# EAGLE design robomow_usb (EAGLE 9.6.2)
Assembly variants: ROBOMOW, SORENSEN
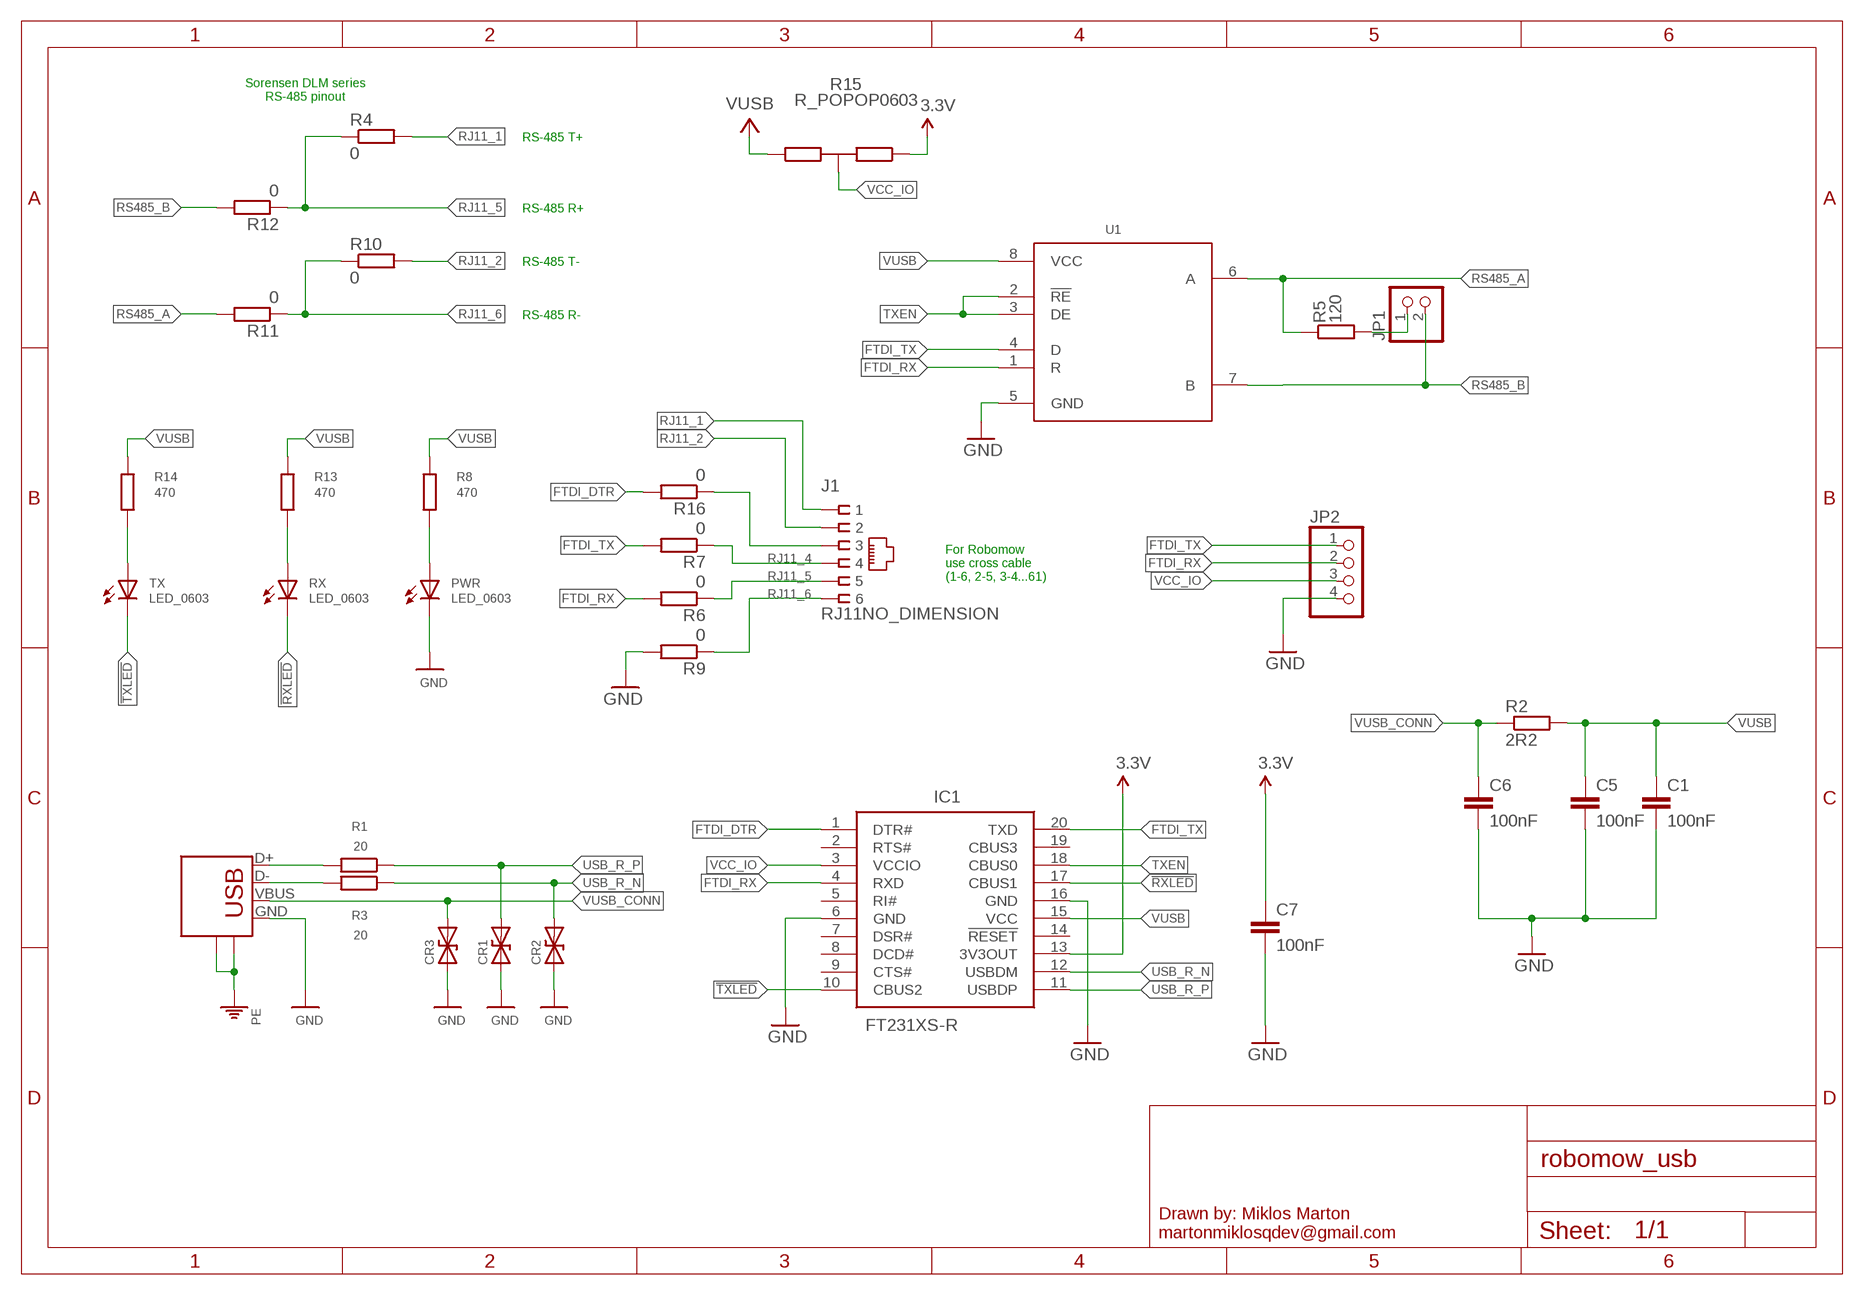
[diagram p0: schematic, sheet 1]

## Parts
C1  100nF  C-EUC0603  [C0603]  (not fitted in variant ROBOMOW)
C5  100nF  C-EUC0603  [C0603]
C6  100nF  C-EUC0603  [C0603]
C7  100nF  C-EUC0603  [C0603]
CR1  0603ESDA2-TR2  [0603]
CR2  0603ESDA2-TR2  [0603]
CR3  0603ESDA2-TR2  [0603]
IC1  FT231XS-R  [SOP64P599X175-20N]
J1  RJ11NO_DIMENSION  [RJ11-NO_SHIELD_NO_DIMENSION]
JP1  PINHD-1X2  [1X02]  (not fitted in variant ROBOMOW)
JP2  PINHD-1X4  [1X04]
JUSB  USBPTH  [USB-B-PTH]
PWR  LED_0603  LED-0603  [LED-603]
R1  20  R-EU_R0603  [R0603]
R2  2R2  R-EU_R0603  [R0603]
R3  20  R-EU_R0603  [R0603]
R4  0  R-EU_R0603  [R0603]  (not fitted in variant ROBOMOW)
R5  120  R-EU_R0603  [R0603]  (not fitted in variant ROBOMOW)
R6  0  R-EU_R0603  [R0603]  (not fitted in variant SORENSEN)
R7  0  R-EU_R0603  [R0603]  (not fitted in variant SORENSEN)
R8  470  R-EU_R0603  [R0603]
R9  0  R-EU_R0603  [R0603]  (not fitted in variant SORENSEN)
R10  0  R-EU_R0603  [R0603]  (not fitted in variant ROBOMOW)
R11  0  R-EU_R0603  [R0603]  (not fitted in variant ROBOMOW)
R12  0  R-EU_R0603  [R0603]  (not fitted in variant ROBOMOW)
R13  470  R-EU_R0603  [R0603]
R14  470  R-EU_R0603  [R0603]
R15  R_POPOP0603  [0603_POPOP]
R16  0  R-EU_R0603  [R0603]
RX  LED_0603  LED-0603  [LED-603]
TX  LED_0603  LED-0603  [LED-603]
U1  SN65HVD1176  SN65HVD1176DR  [D0008A_N]  (not fitted in variant ROBOMOW)

## Nets
3.3V: C7.1 IC1.13(3V3OUT) R15.A
!RXLED: IC1.17(CBUS1) RX.C
!TXLED: IC1.10(CBUS2) TX.C
FTDI_DTR: IC1.1(DTR#) R16.2
FTDI_RX: IC1.4(RXD) JP2.2 R6.2 U1.1(R)
FTDI_TX: IC1.20(TXD) JP2.1 R7.2 U1.4(D)
GND: C1.2 C5.2 C6.2 C7.2 CR1.1 CR2.1 CR3.1 IC1.6(GND) IC1.16(GND) JP2.4 JUSB.GND PWR.C R9.2 U1.5(GND)
N$1: J1.3 R16.1
PE: JUSB.P$1(SH1) JUSB.P$2(SH2)
RJ11_1: J1.1 R4.2
RJ11_2: J1.2 R10.2
RJ11_4: J1.4 R7.1
RJ11_5: J1.5 R4.1 R6.1 R12.1
RJ11_6: J1.6 R9.1 R10.1 R11.1
RS485_A: R5.1 R11.2 U1.6(A)
RS485_B: JP1.2 R12.2 U1.7(B)
RS485_TERM_ENABLE: JP1.1 R5.2
TXEN: IC1.18(CBUS0) U1.2(!RE) U1.3(DE)
USB_N [USB_DN]: JUSB.D- R3.2
USB_P [USB_DP]: JUSB.D+ R1.2
USB_R_N: CR2.2 IC1.12(USBDM) R3.1
USB_R_P: CR1.2 IC1.11(USBDP) R1.1
VCC_IO: IC1.3(VCCIO) JP2.3 R15.COM
VIN_LED_R1: PWR.A R8.2
VIN_LED_R2: R13.2 RX.A
VIN_LED_R3: R14.2 TX.A
VUSB: C1.1 C5.1 IC1.15(VCC) R2.2 R8.1 R13.1 R14.1 R15.A1(B) U1.8(VCC)
VUSB_CONN: C6.1 CR3.2 JUSB.VBUS R2.1
Unconnected: IC1.2(RTS#) IC1.5(RI#) IC1.7(DSR#) IC1.8(DCD#) IC1.9(CTS#) IC1.14(!RESET) IC1.19(CBUS3)

## Notes on the sheet
- Sorensen DLM series
  RS-485 pinout
- RS-485 T+
- RS-485 R+
- RS-485 T-
- RS-485 R-
- For Robomow
  use cross cable
  (1-6, 2-5, 3-4...61)

## Library data of the parts
C1 C5-C7 = rcl:C-EU: CAPACITOR, European symbol
CR1 CR2 = diode:0603ESDA2-TR2; NI_PN: 730401-01; OC_FARNELL: 1828736
CR3 = diode:0603ESDA2-TR2; NI_PN: 730401-01; OC_FARNELL: 1828736; OC_TME: B72500D0050A060
IC1 = FT231XS-R:FT231XS-R: FTDI Chip FT231XS-R, Interface RS232, RS422, RS485, SIE, UART 3MBd, 5 V, 20-pin, SSOP Source: Datasheet <http://uk.rs-online.com/web/p/products/7570032P>; DESCRIPTION: FTDI Chip FT231XS-R, Interface RS232, RS422, RS485, SIE, UART 3MBd, 5 V, 20-pin, SSOP; HEIGHT: 1.7526mm; MANUFACTURER_NAME: FTDI Chip; MANUFACTURER_PART_NUMBER: FT231XS-R; RS_PART_NUMBER: 7570032P
J1 = con-tycoelectronics:RJ11: CORCOM Modular RJ Jacks No Shield Source: www.tycoelectronics.com .. ENG_DS_1654001_1099_RJ_L_0507.pdf
JP1 = pinhead:PINHD-1X2: PIN HEADER
JP2 = pinhead:PINHD-1X4: PIN HEADER
JUSB = usb:USB: USB Connectors USB-B-PTH is fully proven SKU : PRT-00139 USB-miniB is fully proven SKU : PRT-00587 USB-A-PCB is untested. USB-A-H is throughly reviewed, but untested. Spark Fun Electronics SKU : PRT-00437 USB-B-SMT is throughly reviewed, but untested. Needs silkscreen touching up. USB-A-S has not been used/tested USB-MB-H has not been used/tested; OC_FARNELL: 2112373; OC_TME: USB-B-S-RA
PWR RX TX = dp_devices:LED: Light Emitting Diode
R1 R3 = rcl:R-EU_: RESISTOR, European symbol; OC_TME: SMD0805-20R
R2 R4-R7 R9-R12 R16 = rcl:R-EU_: RESISTOR, European symbol
R8 R13 R14 = rcl:R-EU_: RESISTOR, European symbol; OC_TME: 0603SAF1001T5E
R15 = martonmiklos:R_POPOP
U1 = SN65HVD1176D:SN65HVD1176DR; MANUFACTURER: Texas Instruments; PARTNUMBER: SN65HVD1176DR

## Net classes
0 default: width 0.203 mm
4 USB_DP: width 1.143 mm, drill 0.5 mm
5 USB_DN: width 1.143 mm, drill 0.5 mm, clearance 0.15 mm to class 4

## Board
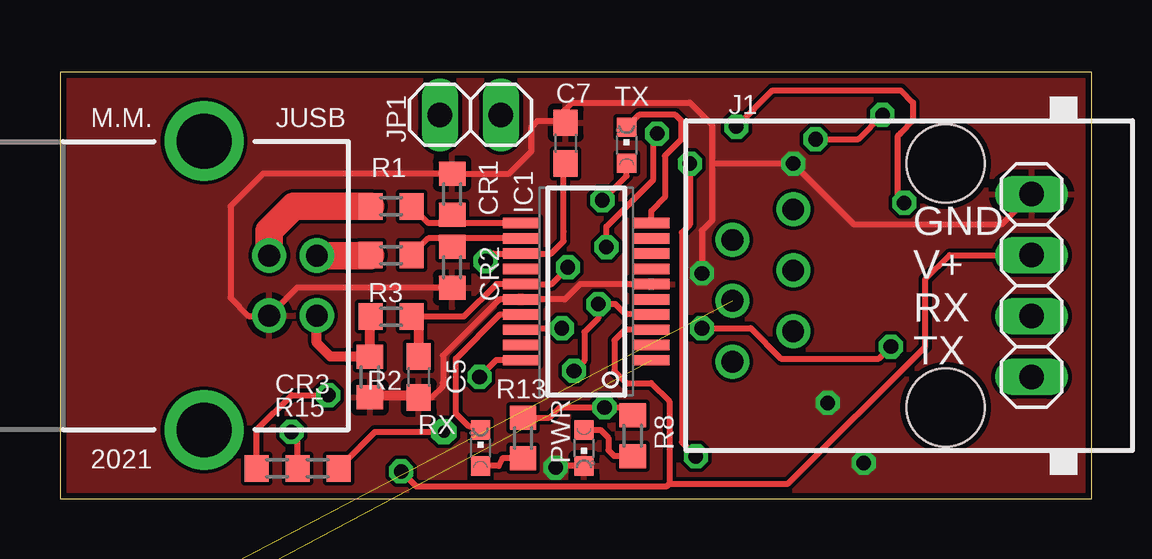
[diagram p1: board, top side]
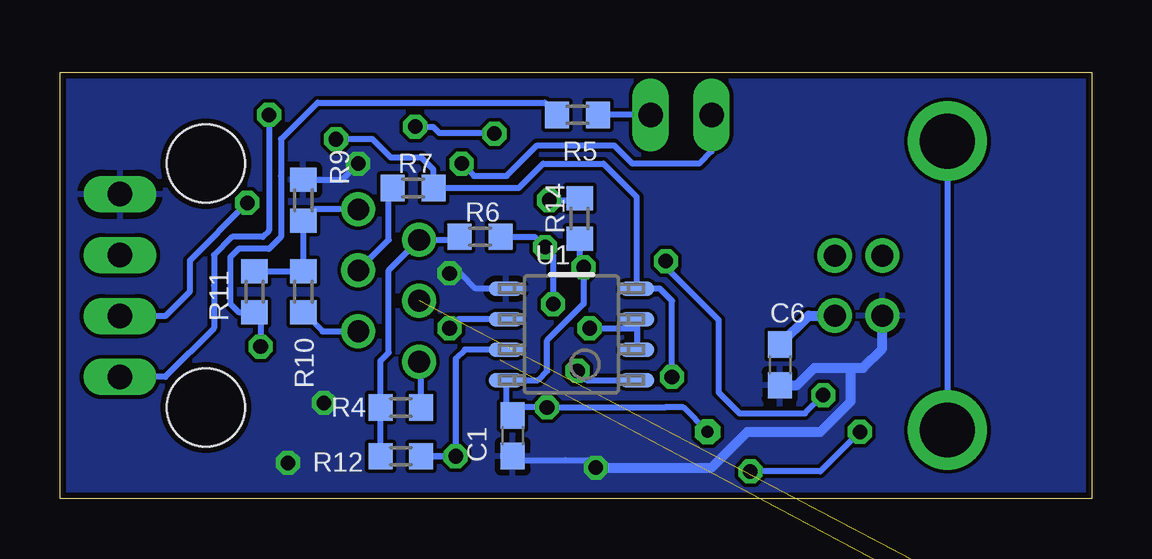
[diagram p2: board, bottom side, seen from below]

Size 43 x 17.78 mm. Coordinates in mm from the lower left corner, seen from the top.
Outline: 43,0 43,17.78 0,17.78 0,0 43,0
Copper layers (1*16): Top 0.035mm / dielectric 1.5mm / Bottom 0.035mm
Design rules "dirt_cheap_dirty_boards.v1": minimum track width 5mil, minimum drill 0.3mm, track to track 6mil, track to pad 6mil, pad to pad 6mil, via to via 6mil, smd to smd 0mil, copper to edge 10mil, drill to drill 10mil, minimum pad ring 10mil, minimum via ring 6mil, stop-mask expansion 2mil, vias tented up to drill 25mil, thermal gap 10mil

### Footprints (pad centres in the part's own frame; a part is rotated, then mirrored left to right if it is on the bottom)
C0603 = smd 1.1 x 1: 1 -0.85,0; 2 0.85,0
0603 = smd 1 x 1.1: 1 -0.85,0; 2 0.85,0
SOP64P599X175-20N = smd 1.526 x 0.435: 1 -2.712,2.858; 2 -2.712,2.222; 3 -2.712,1.588; 4 -2.712,0.952; 5 -2.712,0.318; 6 -2.712,-0.318; 7 -2.712,-0.952; 8 -2.712,-1.588; 9 -2.712,-2.222; 10 -2.712,-2.858; 11 2.712,-2.858; 12 2.712,-2.222; 13 2.712,-1.588; 14 2.712,-0.952; 15 2.712,-0.318; 16 2.712,0.318; 17 2.712,0.952; 18 2.712,1.588; 19 2.712,2.222; 20 2.712,2.858
RJ11-NO_SHIELD_NO_DIMENSION = drill 0.9 pad 1.4: 1 -3.175,8.89; 2 -1.905,6.35; 3 -0.635,8.89; 4 0.635,6.35; 5 1.905,8.89; 6 3.175,6.35 | hole 3.251: -5.08,0; 5.08,0
1X02 = drill 1.016 long: 1 -1.27,0; 2 1.27,0
1X04 = drill 1.016 long: 1 -3.81,0; 2 -1.27,0; 3 1.27,0; 4 3.81,0
USB-B-PTH = drill 0.914: D+ 0,1.25; D- 1.981,1.25; GND 0,-1.25; VBUS 1.981,-1.25 | drill 2.286: P$1 -2.718,-6.02; P$2 -2.718,6.02
LED-603 = smd 0.8 x 0.8: A 0,-0.75; C 0,0.75
R0603 = smd 1 x 1.1: 1 -0.85,0; 2 0.85,0
0603_POPOP = smd 1 x 1.1: A -1.7,0; A1 1.7,0; COM 0,0
D0008A_N = smd 1.45 x 0.6: 1 -2.725,1.905; 2 -2.725,0.635; 3 -2.725,-0.635; 4 -2.725,-1.905; 5 2.725,-1.905; 6 2.725,-0.635; 7 2.725,0.635; 8 2.725,1.905

### Placement (x,y rotation side)
C1  24.13,2.63 270 bottom  (not fitted)
C5  14.95,5.08 270 top
C6  12.99,5.59 270 bottom
C7  21.08,14.82 90 top
CR1  16.35,12.7 270 top
CR2  16.35,9.65 90 top
CR3  12.92,5.08 90 top
IC1  21.93,8.64 180 top
J1  36.92,8.89 90 top
JP1  17.11,16 180 top  (not fitted)
JP2  40.5,8.89 90 top
JUSB  8.73,8.89 0 top
PWR  21.84,2.12 180 top
R1  13.81,12.19 180 top
R2  13.81,7.59 0 top
R3  13.81,10.16 180 top
R4  28.79,3.81 0 bottom  (not fitted)
R5  21.43,16 0 bottom  (not fitted)
R6  25.49,10.92 0 bottom
R7  28.28,12.95 0 bottom
R8  23.88,2.63 270 top
R9  32.86,12.45 90 bottom
R10  32.86,8.64 270 bottom  (not fitted)
R11  34.89,8.64 270 bottom  (not fitted)
R12  28.79,1.78 0 bottom  (not fitted)
R13  19.3,2.54 270 top
R14  21.34,11.68 90 bottom
R15  9.91,1.27 0 top
R16  -2.29,-8.13 0 top  (outside the outline)
RX  17.53,2.12 0 top
TX  23.62,14.73 0 top
U1  21.68,6.86 180 bottom  (not fitted)

### Tracks (layer width: path | path; a pad name or v marks a point on that pad's centre or on a via)
3.3V  (via drill 0.61 pad 1)
  Top 0.254: C7.1 21,14.19 21,11.14 21,10.75 20.47,10.22 IC1.13 18.07,10.22 v17.75,9.91 | R15.A 8.21,2.87 9.66,4.33 v11.18,4.33
  Bottom 0.254: v17.75,9.91 17.78,9.91 17.78,9.69 15.54,7.46 15.54,4.44 14.67,3.56 11.95,3.56 v11.18,4.33
!RXLED
  Top 0.254: RX.C 17.03,3.04 16.51,3.56 16.51,5.84 18.35,7.68 IC1.17
!TXLED
  Top 0.254: TX.C 24.14,16 25.65,16 25.91,15.75 25.91,14.98 25.22,14.29 25.22,12.57 24.65,11.99 IC1.10
FTDI_DTR  (1 unrouted)
FTDI_RX  (via drill 0.61 pad 1)
  Top 0.254: IC1.4 23.58,7.68 23.15,8.12 v22.44,8.12 22.44,7.54 21.86,6.95 21.86,5.77 v21.43,5.33 | v22.78,10.5 22.78,11.35 24.73,13.3 24.73,15.08 24.88,15.22 v24.89,15.22 | v28.19,15.51 29.7,17.02 35.05,17.02 35.56,16.51 35.56,15.75 35.05,15.24 34.91,15.1 34.91,12.59 35.17,12.33 v35.19,12.33
  Bottom 0.254: R6.2 23.2,10.92 v22.78,10.5 22.44,10.16 v22.44,8.12 | v21.43,5.33 21.05,4.95 U1.1 | v24.89,15.22 25.15,15.22 25.16,15.24 27.18,15.24 27.43,15.49 28.19,15.49 v28.19,15.51 | v35.19,12.33 37.59,9.93 37.59,8.64 38.61,7.62 JP2.2
FTDI_TX  (via drill 0.61 pad 1)
  Top 0.254: IC1.20 18.19,5.78 v17.49,5.08 | v31.5,14.99 33.27,14.99 v34.29,16
  Bottom 0.254: v17.49,5.08 17.49,8.26 18,8.76 U1.4 18.95,12.57 20.35,13.97 22.86,13.97 23.88,12.95 R7.2 27.43,13.72 27.95,14.23 29.22,14.23 29.97,14.99 v31.5,14.99 | JP2.1 38.61,5.08 36.58,7.11 36.58,8.89 36.58,10.16 35.81,10.92 34.54,10.92 34.29,11.18 v34.29,16
GND  (via drill 0.61 pad 1)
  Top 0.254: IC1.6 23.2,8.95 22.53,8.95 21.68,8.95 21.04,8.32 IC1.16 18.31,8.32 15.96,5.97 15.96,4.83 15.96,4.7 15.5,4.23 C5.2 | 14.95,4.32 C5.2 | 15.2,4.23 C5.2 | v26.76,9.4 26.76,11.18 27.18,11.59 27.18,13.47 27.18,13.97 | PWR.C 20.73,1.37 v20.66,1.31 | 20.83,15.75 19.9,15.75 19.65,15.49 19.65,14.48 18.72,13.55 CR1.1 8.47,13.55 7.11,12.19 7.11,8.38 7.87,7.62 8.73,7.62 JUSB.GND 9.89,8.8 CR2.1 | 20.83,15.75 21.01,15.75 C7.2 | 20.83,15.75 20.83,16 21.34,16.51 26.25,16.51 27.18,15.58 27.18,13.97 | JP2.4 39.23,11.43 33.11,11.43 v30.57,13.97 29.57,13.97 27.18,13.97
  Top 0.406: 14.95,4.32 13.01,4.32 CR3.1
  Bottom 0.254: R9.2 31.24,13.3 v30.57,13.97 | v20.66,1.31 20.97,1.61 21.93,1.61 23.96,1.61 C1.2 | U1.5 25.68,8.76 26.31,9.4 v26.76,9.4
  Bottom 0.406: 10.03,5.46 11.56,5.46 12.06,4.95 12.28,4.74 C6.2 | 10.03,5.46 9.53,5.46 8.73,6.26 JUSB.GND | v20.66,1.31 15.84,1.31 14.35,2.79 11.3,2.79 10.03,4.06 10.03,5.46
  other vias: 33.5,1.5 32,4
  pour Top: 43,17.78 43,0 0,0 0,17.78
  pour Bottom: 43,17.78 43,0 0,0 0,17.78
N$1  (1 unrouted)
PE
  Bottom 0.254: JUSB.P$2 JUSB.P$1
RJ11_1
  Bottom 0.254: R4.2 27.94,5.63 J1.1
RJ11_2
  Bottom 0.254: R10.2 32.05,6.99 J1.2
RJ11_4
  Bottom 0.254: J1.4 29.3,10.79 29.3,12.79 R7.1
RJ11_5
  Bottom 0.254: R6.1 26.47,10.79 J1.5 29.3,9.53 29.3,6.1 29.64,5.75 R4.1 R12.1
RJ11_6
  Bottom 0.254: J1.6 32.39,12.06 R9.1 R10.1 R11.1
RS485_A  (via drill 0.61 pad 1)
  Top 0.254: v26.76,7.11 28.79,7.11 30.06,5.84 34.13,5.84 v34.63,6.35
  Bottom 0.254: U1.6 26.38,7.49 v26.76,7.11 | v34.63,6.35 34.63,7.53 R11.2 35.56,7.79 35.9,8.13 35.9,10.07 35.56,10.41 34.29,10.41 33.78,10.92 33.78,13.46 33.78,14.99 32.26,16.51 22.78,16.51 R5.1
RS485_B  (via drill 0.61 pad 1)
  Top 0.254: v26.51,1.78 25.92,2.36 25.92,11.1 26.25,11.43 v26.25,13.97
  Bottom 0.254: R12.2 27.78,1.78 | 27.78,1.78 26.76,1.78 26.51,2.03 26.51,5.84 26.12,6.22 U1.7 | JP1.2 15.84,14.48 16.35,13.97 19.14,13.97 19.9,14.73 23.11,14.73 24.38,13.46 25.74,13.46 v26.25,13.97 | v26.51,1.78 27.78,1.78
RS485_TERM_ENABLE
  Bottom 0.254: JP1.1 R5.2
TXEN  (via drill 0.61 pad 1)
  Top 0.254: IC1.18 19.29,7.11 v20.92,7.11
  Bottom 0.254: U1.2 U1.3 18.95,7.11 v20.92,7.11
USB_N
  Top 1.143: R3.2 12.94,10.14 JUSB.D-
USB_P
  Top 1.143: R1.2 9.74,12.19 8.73,11.18 JUSB.D+
USB_R_N
  Top 0.254: IC1.12 16.35,10.86 | 16.35,10.86 15.35,10.86 R3.1 | CR2.2 16.35,10.86
USB_R_P
  Top 0.254: IC1.11 16.35,11.49 | 16.35,11.49 15.35,11.49 R1.1 | CR1.2 16.35,11.49
VCC_IO  (via drill 0.61 pad 1)
  Top 0.254: v9.65,2.79 9.91,2.54 R15.COM | IC1.3 23.56,7.05 23.11,6.6 23.11,5.33 23.62,4.83 24.64,4.83 25.4,4.06 25.4,0.64 | v14.22,1.14 14.86,0.51 16.26,0.51 25.27,0.51 25.4,0.64 | 25.4,0.64 30.35,0.64 36.07,6.35 36.07,9.14 37.08,10.16 JP2.3
  Bottom 0.254: v9.65,2.79 11.3,1.14 v14.22,1.14
VIN_LED_R1
  Top 0.254: PWR.A 22.53,2.87 22.86,2.54 22.86,2.03 23.11,1.78 R8.2
VIN_LED_R2
  Top 0.254: R13.2 18.44,1.69 18.29,1.37 RX.A
VIN_LED_R3  (via drill 0.61 pad 1)
  Top 0.254: v22.61,12.45 23.62,13.46 TX.A
  Bottom 0.254: v22.61,12.45 21.42,12.45 R14.2
VUSB  (via drill 0.5 pad 1.05, 0.61 pad 1)
  Top 0.254: v21.17,9.65 21.17,9.63 20.49,8.95 IC1.15 18.19,8.95 16.83,7.59 R2.2 | 15.16,5.93 C5.1 | R13.1 20.41,3.39 20.83,3.81 v22.7,3.81 23.38,3.81 23.8,3.39 23.88,3.47 R8.1 | R15.A1 13.13,2.79 v16,2.79
  Top 0.406: R2.2 14.95,7.3 C5.1
  Bottom 0.254: R14.1 21.34,9.82 v21.17,9.65 21.17,8.13 22.7,6.6 22.7,5.33 23.08,4.95 U1.8 24.41,3.75 C1.1 23.8,3.81 v22.7,3.81 17.78,3.81 17.02,3.81 v16,2.79
VUSB_CONN
  Top 0.254: 12.73,6.12 CR3.2
  Top 0.406: JUSB.VBUS 10.71,6.5 11.27,5.93 CR3.2 12.92,7.56 R2.1
  Bottom 0.406: C6.1 11.79,7.64 JUSB.VBUS

### Text on the board
tNames: M.M. | GND / V+ / RX / TX | 2021